# Altium schematic sheet 24V_Load_Switches.SchDoc: Title
size A3; Project: Q24 VCU; ENG_APP_DATE: --/--/--; DSN_APP_DATE: --/--/--; CHK_APP_DATE: --/--/--; Date: *******; ApprovedBy: *******; CheckedBy: None; Author: *******; CompanyName: *******; DrawnBy: Jacob Chisholm; Engineer: *******; Organization: *******; Address1: *******; Address2: *******; Address3: *******; Address4: *******; DocumentNumber: 5; Revision: *******; SheetNumber: 5; SheetTotal: 14; Address_Website: https://jchisholm204.github.io; E-Mail: JacobChisholm1010@gmail.com; CurrentTime: *******; CurrentDate: *******; Time: *******; DocumentFullPathAndName: *******; DocumentName: *******; ModifiedDate: *******; ImagePath: *******; ProjectName: *******; Application_BuildNumber: *******
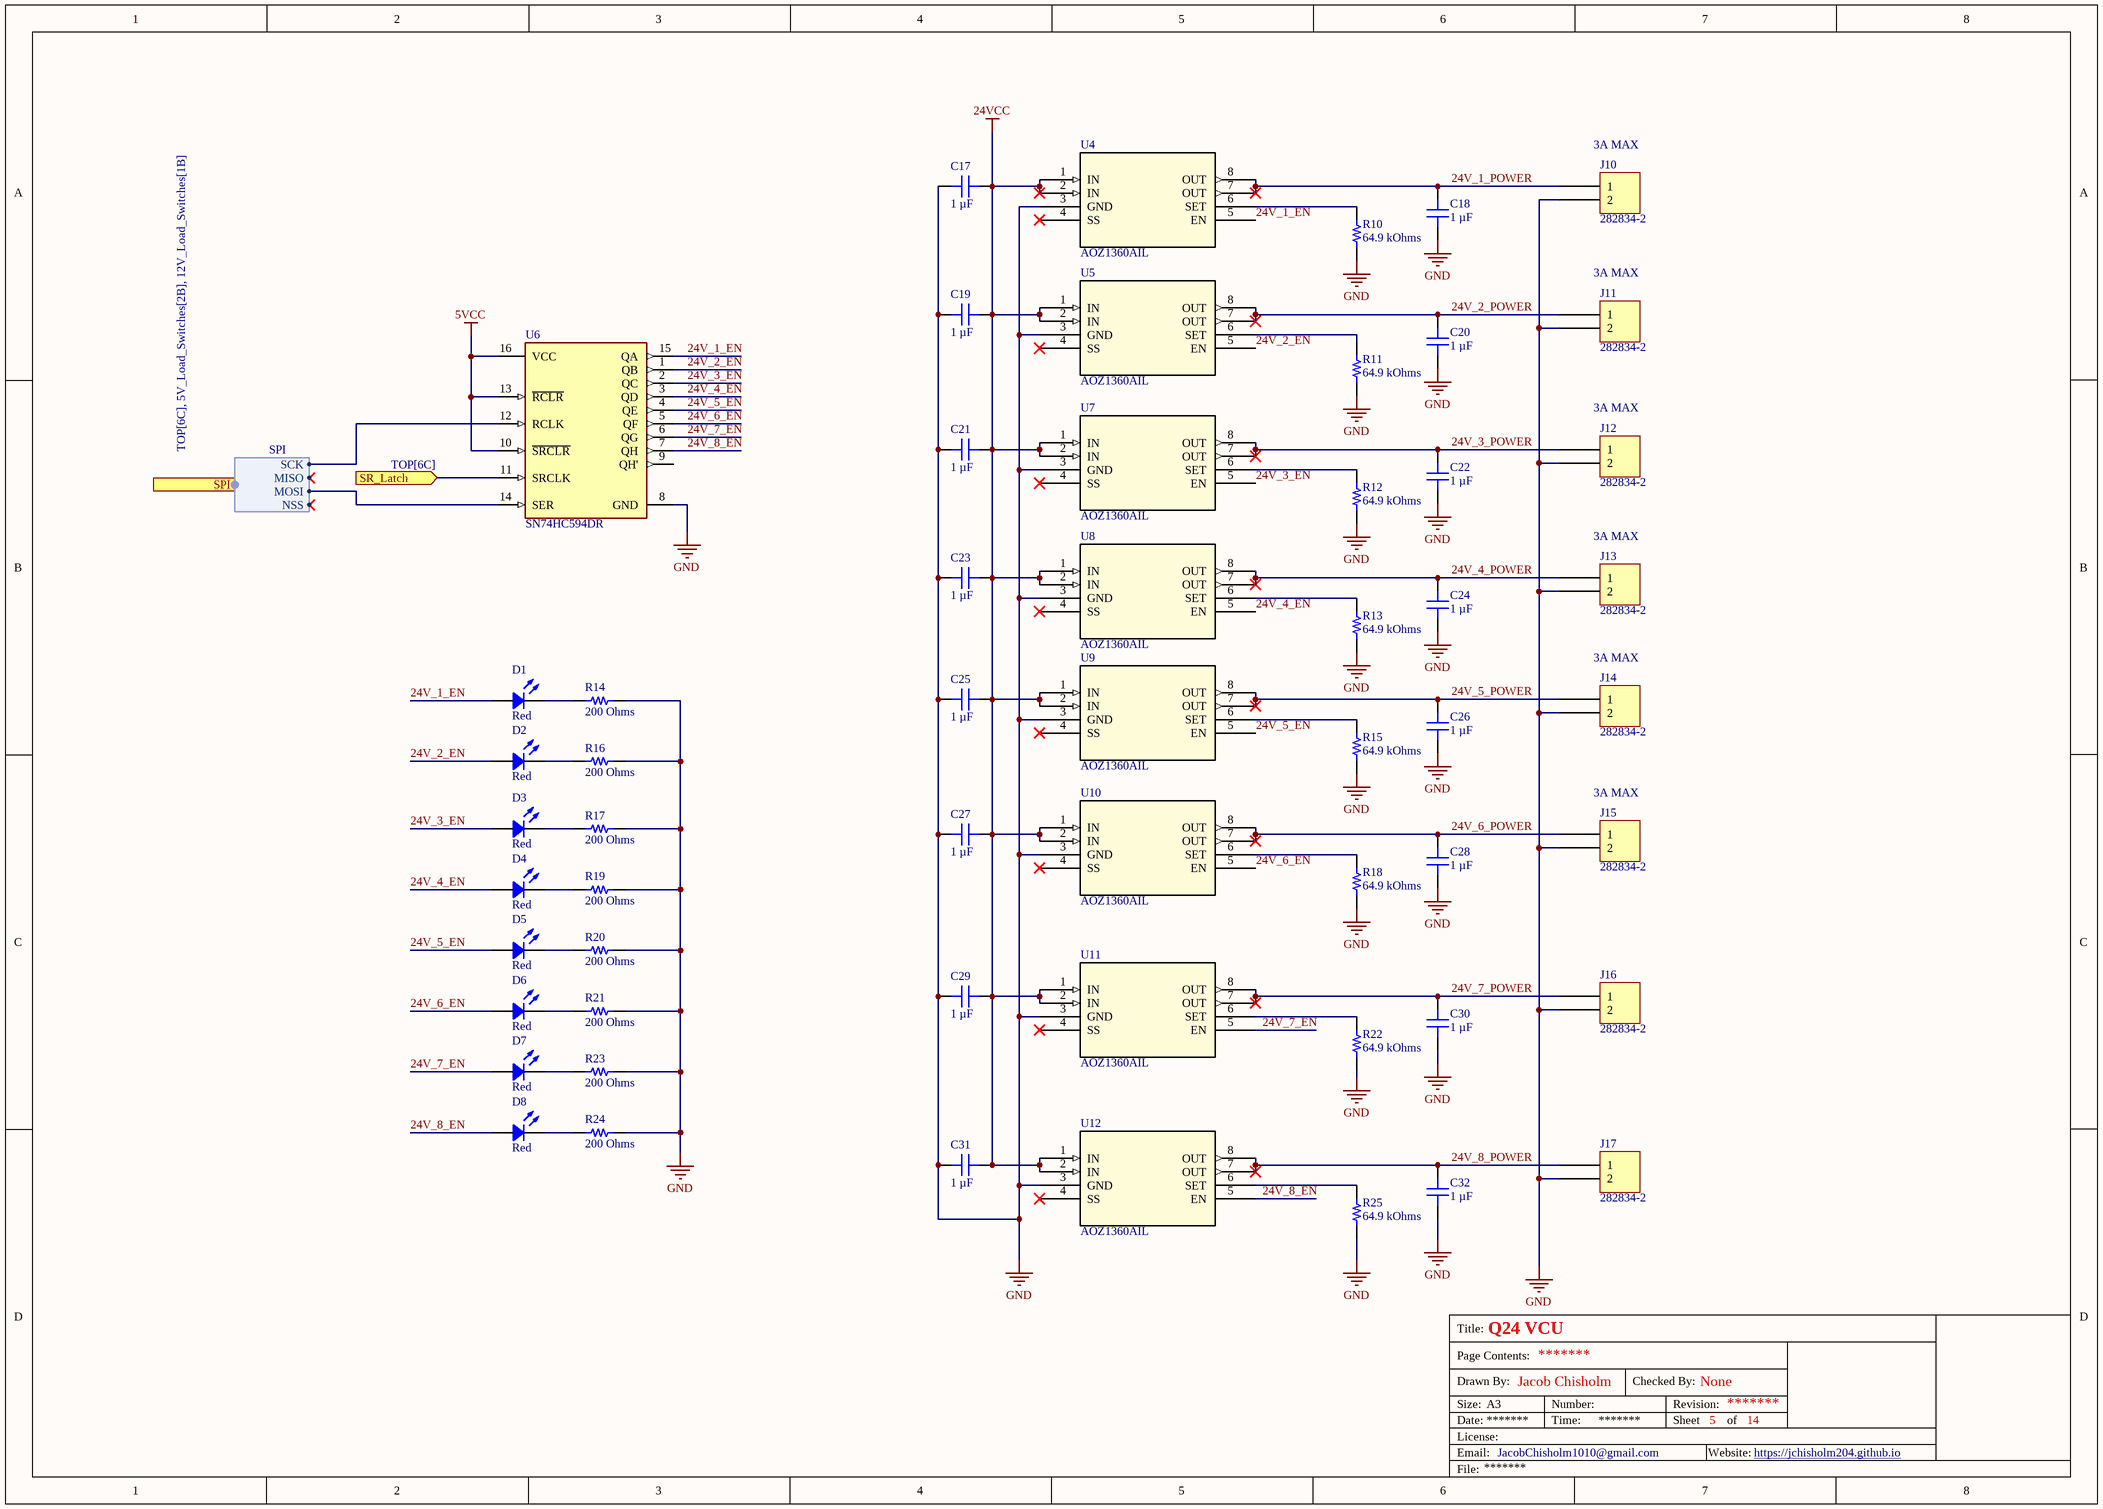
[diagram p0: 24V_Load_Switches.SchDoc]

## Parts
C17  1 µF  [CAP 0805_2012]
C18  1 µF  [CAP 0805_2012]
C19  1 µF  [CAP 0805_2012]
C20  1 µF  [CAP 0805_2012]
C21  1 µF  [CAP 0805_2012]
C22  1 µF  [CAP 0805_2012]
C23  1 µF  [CAP 0805_2012]
C24  1 µF  [CAP 0805_2012]
C25  1 µF  [CAP 0805_2012]
C26  1 µF  [CAP 0805_2012]
C27  1 µF  [CAP 0805_2012]
C28  1 µF  [CAP 0805_2012]
C29  1 µF  [CAP 0805_2012]
C30  1 µF  [CAP 0805_2012]
C31  1 µF  [CAP 0805_2012]
C32  1 µF  [CAP 0805_2012]
D1  Red  [LED 0603_1608 RED]
D2  Red  [LED 0603_1608 RED]
D3  Red  [LED 0603_1608 RED]
D4  Red  [LED 0603_1608 RED]
D5  Red  [LED 0603_1608 RED]
D6  Red  [LED 0603_1608 RED]
D7  Red  [LED 0603_1608 RED]
D8  Red  [LED 0603_1608 RED]
J10  282834-2  [TE 282834-2]
J11  282834-2  [TE 282834-2]
J12  282834-2  [TE 282834-2]
J13  282834-2  [TE 282834-2]
J14  282834-2  [TE 282834-2]
J15  282834-2  [TE 282834-2]
J16  282834-2  [TE 282834-2]
J17  282834-2  [TE 282834-2]
R10  64.9 kOhms  [RES 0603_1608]
R11  64.9 kOhms  [RES 0603_1608]
R12  64.9 kOhms  [RES 0603_1608]
R13  64.9 kOhms  [RES 0603_1608]
R14  200 Ohms  [RES 0603_1608]
R15  64.9 kOhms  [RES 0603_1608]
R16  200 Ohms  [RES 0603_1608]
R17  200 Ohms  [RES 0603_1608]
R18  64.9 kOhms  [RES 0603_1608]
R19  200 Ohms  [RES 0603_1608]
R20  200 Ohms  [RES 0603_1608]
R21  200 Ohms  [RES 0603_1608]
R22  64.9 kOhms  [RES 0603_1608]
R23  200 Ohms  [RES 0603_1608]
R24  200 Ohms  [RES 0603_1608]
R25  64.9 kOhms  [RES 0603_1608]
U4  AOZ1360AIL  [AOZ1360AIL_AOS]
U5  AOZ1360AIL  [AOZ1360AIL_AOS]
U6  SN74HC594DR  [FP-D0016A-IPC_A]
U7  AOZ1360AIL  [AOZ1360AIL_AOS]
U8  AOZ1360AIL  [AOZ1360AIL_AOS]
U9  AOZ1360AIL  [AOZ1360AIL_AOS]
U10  AOZ1360AIL  [AOZ1360AIL_AOS]
U11  AOZ1360AIL  [AOZ1360AIL_AOS]
U12  AOZ1360AIL  [AOZ1360AIL_AOS]

## Ports
SPI (harness SPI, see TOP[6C], 5V_Load_Switches[2B], 12V_Load_Switches[1B]), SR_Latch (in, see TOP[6C])

## Harnesses
SPI: NSS, SCK, MISO, MOSI

## Nets
5VCC: U6.10(~{SRCLR}) U6.13(~{RCLR}) U6.16(VCC)
24VCC: C17.1 C19.1 C21.1 C23.1 C25.1 C27.1 C29.2 C31.2 U4.1(IN) U4.2(IN) U5.1(IN) U5.2(IN) U7.1(IN) U7.2(IN) U8.1(IN) U8.2(IN) U9.1(IN) U9.2(IN) U10.1(IN) U10.2(IN) U11.1(IN) U11.2(IN) U12.1(IN) U12.2(IN)
GND: C17.2 C18.1 C19.2 C20.1 C21.2 C22.1 C23.2 C24.1 C25.2 C26.1 C27.2 C28.1 C29.1 C30.1 C31.1 C32.1 J10.2 J11.2 J12.2 J13.2 J14.2 J15.2 J16.2 J17.2 R10.1 R11.1 R12.1 R13.1 R14.2 R15.1 R16.2 R17.2 R18.1 R19.2 R20.2 R21.2 R22.1 R23.2 R24.2 R25.1 U4.3(GND) U5.3(GND) U6.8(GND) U7.3(GND) U8.3(GND) U9.3(GND) U10.3(GND) U11.3(GND) U12.3(GND)
24V_1_EN: D1.1 U4.5(EN) U6.15(QA)
24V_1_POWER: C18.2 J10.1 U4.7(OUT) U4.8(OUT)
24V_2_EN: D2.1 U5.5(EN) U6.1(QB)
24V_2_POWER: C20.2 J11.1 U5.7(OUT) U5.8(OUT)
24V_3_EN: D3.1 U6.2(QC) U7.5(EN)
24V_3_POWER: C22.2 J12.1 U7.7(OUT) U7.8(OUT)
24V_4_EN: D4.1 U6.3(QD) U8.5(EN)
24V_4_POWER: C24.2 J13.1 U8.7(OUT) U8.8(OUT)
24V_5_EN: D5.1 U6.4(QE) U9.5(EN)
24V_5_POWER: C26.2 J14.1 U9.7(OUT) U9.8(OUT)
24V_6_EN: D6.1 U6.5(QF) U10.5(EN)
24V_6_POWER: C28.2 J15.1 U10.7(OUT) U10.8(OUT)
24V_7_EN: D7.1 U6.6(QG) U11.5(EN)
24V_7_POWER: C30.2 J16.1 U11.7(OUT) U11.8(OUT)
24V_8_EN: D8.1 U6.7(QH) U12.5(EN)
24V_8_POWER: C32.2 J17.1 U12.7(OUT) U12.8(OUT)
SR_Latch: U6.11(SRCLK) ; port SR_Latch
NetD1_2: D1.2 R14.1
NetD2_2: D2.2 R16.1
NetD3_2: D3.2 R17.1
NetD4_2: D4.2 R19.1
NetD5_2: D5.2 R20.1
NetD6_2: D6.2 R21.1
NetD7_2: D7.2 R23.1
NetD8_2: D8.2 R24.1
NetR10_2: R10.2 U4.6(SET)
NetR11_2: R11.2 U5.6(SET)
NetR12_2: R12.2 U7.6(SET)
NetR13_2: R13.2 U8.6(SET)
NetR15_2: R15.2 U9.6(SET)
NetR18_2: R18.2 U10.6(SET)
NetR22_2: R22.2 U11.6(SET)
NetR25_2: R25.2 U12.6(SET)
NetU6_12: U6.12(RCLK) ; port SPI.SCK
NetU6_14: U6.14(SER) ; port SPI.MOSI

Not connected (* = marked no-connect by the designer): U4 4(SS)*; U5 4(SS)*; U6 9(QH'); U7 4(SS)*; U8 4(SS)*; U9 4(SS)*; U10 4(SS)*; U11 4(SS)*; U12 4(SS)*

## Notes on the sheet
- (near J10) 3A MAX
- (near J11) 3A MAX
- (near J12) 3A MAX
- (near J13) 3A MAX
- (near J14) 3A MAX
- (near J15) 3A MAX
- Title:
- Drawn By:
- Page Contents:
- Checked By:
- Size:
- Date:
- File:
- License:
- Email:
- A3
- Number:
- Time:
- Revision:
- Sheet
- Website:
- of

## Library data of the parts
C17-C28 = GCJ21BR71H105KA01L: CAP CER 1UF 50V X7R 0805; manufacturer: Murata Electronics; Tolerance: ±10%; Part Number: GCJ21BR71H105KA01L; Value: 1 µF; Applications: Automotive, Boardflex Sensitive; Capacitance: 1 µF; componentlink1description: Datasheet; componentlink1url: https://www.murata.com/~/media/webrenewal/support/library/catalog/products/capacitor/mlcc/c03e.ashx?la=en-us; componentlink2description: DigiKey Link; componentlink2url: https://www.digikey.com/en/products/detail/murata-electronics/GCJ21BR71H105KA01L/4903512; Device Package: 0805 (2012 Metric); Features: Soft Termination; lastupdated: 12/20/2023 8:14:07 PM; Lifecycle Status: Active; Minimum Order: 1; Mounting Type: Surface Mount, MLCC; Operating Temperature: -55°C ~ 125°C; Package / Case: 0805 (2012 Metric); packaging: TapeAndReel; partid: 2709; Part Status: Active; price: 0.05; Ratings: AEC-Q200; series: GCJ; Size / Dimension: 0.079" L x 0.049" W (2.00mm x 1.25mm); Supplier 1: DigiKey; Supplier Part Number 1: 490-10667-1-ND; Temperature Coefficient: X7R; Thickness (Max): 0.057" (1.45mm); Voltage - Rated: 50V
C29-C32 = 08051Z105KAT2A: 0805 X7S 1UF10% 100V; manufacturer: KYOCERA AVX; Tolerance: ±10%; Part Number: 08051Z105KAT2A; Value: 1 µF; Applications: General Purpose; Capacitance: 1 µF; componentlink1description: Datasheet; componentlink1url: https://datasheets.kyocera-avx.com/X7S.pdf; componentlink2description: DigiKey Link; componentlink2url: https://www.digikey.com/en/products/detail/kyocera-avx/08051Z105KAT2A/17866368; Device Package: 0805 (2012 Metric); lastupdated: 2/1/2024 8:13:20 PM; Lifecycle Status: Active; Minimum Order: 1; Mounting Type: Surface Mount, MLCC; Operating Temperature: -55°C ~ 125°C; Package / Case: 0805 (2012 Metric); packaging: TapeAndReel; partid: 54857; Part Status: Active; price: 0.08; series: -; Size / Dimension: 0.079" L x 0.049" W (2.01mm x 1.25mm); Supplier 1: DigiKey; Supplier Part Number 1: 478-08051Z105KAT2ACT-ND; Temperature Coefficient: X7S; Voltage - Rated: 100V
D1-D8 = 19-213SDRC/S259/TR8: LED RED CLEAR 2SMD; Manufacturer: Everlight Electronics Co Ltd; Configuration: Standard; Current - Test: 10mA; Lens Color: Colorless; Lens Size: 1.20mm x 0.80mm; Lens Style: Rectangle with Flat Top; Viewing Angle: 120°; Voltage - Forward (Vf) (Typ): 2V; Wavelength - Peak: 650nm; Part Number: 19-213SDRC/S259/TR8; Color: Red; ComponentLink1Description: Datasheet; ComponentLink1URL: //media.digikey.com/pdf/Data%20Sheets/Everlight%20PDFs/19-213SDRC-S259-TR8.pdf; ComponentLink2Description: DigiKey Link; ComponentLink2URL: http://digikey.com/product-detail/en/everlight-electronics-co-ltd/19-213SDRC-S259-TR8/1080-1580-1-ND/8535303; Device Package: 0603 (1608 Metric); Height (Max): 0.70mm; LastUpdated: 2/2/2024 9:29:56 PM; Lens Transparency: Clear; Lifecycle Status: Active; Minimum Order: 1; Mounting Type: Surface Mount; Package / Case: 0603 (1608 Metric); Packaging: TapeAndReel; PartId: 372; Part Status: Active; Price: 0.06; Series: -; Size / Dimension: 1.60mm L x 0.80mm W; Supplier 1: DigiKey; Supplier Part Number 1: 1080-1580-1-ND; Supplier Device Package: 2-SMD; Value: Red
J10-J17 = 282834-2: TERM BLK 2P SIDE ENT 2.54MM PCB; Manufacturer: TE Connectivity AMP Connectors; Current: 10A; Mating Orientation: Horizontal with Board; Number of Levels: 1; Pitch: 0.100" (2.54mm); Positions Per Level: 2; Voltage: 150V; Wire Gauge: 16-30 AWG; Wire Termination: Screw - Rising Cage Clamp; Part Number: 282834-2; Color: Green; ComponentLink1Description: Datasheet; ComponentLink1URL: https://www.te.com/commerce/DocumentDelivery/DDEController?Action=srchrtrv&DocNm=282834&DocType=Customer+Drawing&DocLang=English; ComponentLink2Description: DigiKey Link; ComponentLink2URL: http://digikey.com/product-detail/en/te-connectivity-amp-connectors/282834-2/A98333-ND/1150135; LastUpdated: 1/15/2020 4:15:38 AM; Lifecycle Status: Active; Minimum Order: 1; Mounting Type: Through Hole; Packaging: Bulk; Part Status: Active; Price: 0.88; Series: Buchanan; Supplier 1: DigiKey; Supplier Part Number 1: A98333-ND
R10-R13 R15 R18 = 7-2176089-3: RES SMD 64.9K OHM 0.1% 1/6W 0603; Manufacturer: TE Connectivity Passive Product; Power (Watts): 0.167W, 1/6W; Temperature Coefficient: ±25ppm/°C; Part Number: 7-2176089-3; Value: 64.9 kOhms; ComponentLink1Description: Datasheet; ComponentLink1URL: https://www.te.com/commerce/DocumentDelivery/DDEController?Action=srchrtrv&DocNm=1773272&DocType=DS&DocLang=English; ComponentLink2Description: DigiKey Link; ComponentLink2URL: https://www.digikey.com/en/products/detail/te-connectivity-passive-product/7-2176089-3/4033750; Composition: Thin Film; Device Package: 0603 (1608 Metric); Height - Seated (Max): 0.022" (0.55mm); LastUpdated: 12/19/2023 8:39:23 PM; Lifecycle Status: Active; Minimum Order: 1; Number of Terminations: 2; Operating Temperature: -55°C ~ 155°C; Package / Case: 0603 (1608 Metric); Packaging: TapeAndReel; PartId: 23912; Part Status: Active; Price: 0.14; Resistance: 64.9 kOhms; Series: RP73P, Holsworthy; Size / Dimension: 0.061" L x 0.031" W (1.55mm x 0.80mm); Supplier 1: DigiKey; Supplier Part Number 1: A110282CT-ND; Supplier Device Package: 0603; Tolerance: ±0.1%
R14 R16 R17 R19-R21 R23 R24 = RS73F1JTTD2000B: RES 200 OHM 0.1% 1/5W 0603; Manufacturer: KOA Speer Electronics, Inc.; Power (Watts): 0.2W, 1/5W; Temperature Coefficient: ±25ppm/°C; Part Number: RS73F1JTTD2000B; Value: 200 Ohms; ComponentLink1Description: Datasheet; ComponentLink1URL: http://www.koaspeer.com/pdfs/RS73.pdf; ComponentLink2Description: DigiKey Link; ComponentLink2URL: https://www.digikey.com/en/products/detail/koa-speer-electronics-inc/RS73F1JTTD2000B/11594419; Composition: Thick Film; Device Package: 0603 (1608 Metric); Features: Automotive AEC-Q200, Moisture Resistant; Height - Seated (Max): 0.022" (0.55mm); LastUpdated: 2/2/2024 8:38:37 PM; Lifecycle Status: Active; Minimum Order: 1; Number of Terminations: 2; Operating Temperature: -55°C ~ 155°C; Package / Case: 0603 (1608 Metric); Packaging: TapeAndReel; PartId: 56369; Part Status: Active; Price: 0.07; Ratings: AEC-Q200; Resistance: 200 Ohms; Series: RS73; Size / Dimension: 0.063" L x 0.031" W (1.60mm x 0.80mm); Supplier 1: DigiKey; Supplier Part Number 1: 2019-RS73F1JTTD2000BCT-ND; Supplier Device Package: 0603; Tolerance: ±0.1%
R22 R25 = PTN0603E6492BST1: RES 64.9K OHM 0.1% 0.15W 0603; Manufacturer: Vishay Thin Film; Temperature Coefficient: ±25ppm/°C; Part Number: PTN0603E6492BST1; Value: 64.9 kOhms; ComponentLink1Description: Datasheet; ComponentLink1URL: http://www.vishay.com/docs/60026/ptn.pdf; ComponentLink2Description: DigiKey Link; ComponentLink2URL: http://digikey.com/product-detail/en/vishay-thin-film/PTN0603E6492BST1/764-1449-1-ND/7103233; Composition: Thin Film; Device Package: 0603 (1608 Metric); Features: Anti-Sulfur, Moisture Resistant, Non-Inductive; Height - Seated (Max): 0.020" (0.51mm); LastUpdated: 2/1/2024 8:39:11 PM; Lifecycle Status: Active; Minimum Order: 1; Number of Terminations: 2; Operating Temperature: -55°C ~ 155°C; Package / Case: 0603 (1608 Metric); Packaging: TapeAndReel; PartId: 22193; Part Status: Active; Power (Watts): 0.15W; Price: 0.21; Resistance: 64.9 kOhms; Series: PTN; Size / Dimension: 0.064" L x 0.032" W (1.63mm x 0.81mm); Supplier 1: DigiKey; Supplier Part Number 1: 764-1449-1-ND; Supplier Device Package: 0603; Tolerance: ±0.1%
U4 U5 U7-U12 = AOZ1360AIL: No Description Available; Mfr_Name: Alpha and Omega Semiconductor; Manufacturer_Part_Number: AOZ1360AIL; RefDes: RefDes; Type: DEV
  U4 U5 U7-U10: Copyright: Copyright (C) 2023 Ultra Librarian. All rights reserved.
  U11 U12: Copyright: Copyright (C) 2024 Ultra Librarian. All rights reserved.
U6 = CMP-0780-00061-4: IC SHIFT REGISTER 8BIT 16-SOIC; Number of Bits per Element: 8; Min Supply Voltage: 2V; Frequency: 40MHz; Max Supply Voltage: 6V; Operating Supply Voltage: 5V; Number of Output Lines: 10; Propagation Delay: 25ns; Number of Elements: 1; Number of Circuits: 4; Direction: Unidirectional; Turn-On Delay Time: 185ns; RoHS Compliant: Yes; Width: 3.91mm; Length: 9.9mm; Min Operating Temperature: -40°C; Max Operating Temperature: 125°C; Package Quantity: 2500; Series: 74HC; Height: 1.58mm; Number of Bits: 8; Mount: Surface Mount; Logic Function: Shift Register; Radiation Hardening: No; Number of Pins: 16; Technology: CMOS; Packaging: Tape and Reel; Lead Free: Lead Free; Weight: 0.004998oz; REACH SVHC: No SVHC; Case/Package: SOIC